# EAGLE design charlie_chain_v1 (EAGLE 5.11)
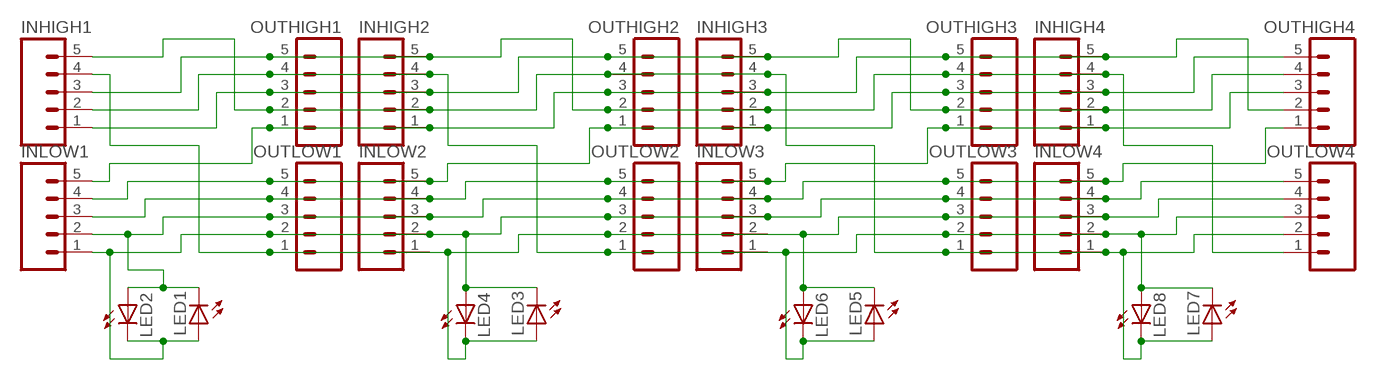
[diagram p0: schematic, sheet 1]

## Parts
INHIGH1  M05PTH  [1X05]
INHIGH2  M05PTH  [1X05]
INHIGH3  M05PTH  [1X05]
INHIGH4  M05PTH  [1X05]
INLOW1  M05PTH  [1X05]
INLOW2  M05PTH  [1X05]
INLOW3  M05PTH  [1X05]
INLOW4  M05PTH  [1X05]
LED1  LED10MM  [LED10MM]
LED2  LED10MM  [LED10MM]
LED3  LED10MM  [LED10MM]
LED4  LED10MM  [LED10MM]
LED5  LED10MM  [LED10MM]
LED6  LED10MM  [LED10MM]
LED7  LED10MM  [LED10MM]
LED8  LED10MM  [LED10MM]
OUTHIGH1  M05PTH  [1X05]
OUTHIGH2  M05PTH  [1X05]
OUTHIGH3  M05PTH  [1X05]
OUTHIGH4  M05PTH  [1X05]
OUTLOW1  M05PTH  [1X05]
OUTLOW2  M05PTH  [1X05]
OUTLOW3  M05PTH  [1X05]
OUTLOW4  M05PTH  [1X05]

## Nets
N$2: INHIGH1.2 INHIGH2.4 INLOW4.2 LED5.A LED6.K(C) LED7.K(C) LED8.A OUTHIGH1.4 OUTLOW2.1 OUTLOW3.2 OUTLOW4.3
N$10: INHIGH4.1 INLOW1.3 INLOW2.4 INLOW3.5 OUTHIGH3.1 OUTHIGH4.3 OUTLOW1.4 OUTLOW2.5
N$11: INHIGH3.1 INHIGH4.3 INLOW1.4 INLOW2.5 OUTHIGH2.1 OUTHIGH3.3 OUTHIGH4.5 OUTLOW1.5
N$12: INHIGH2.1 INHIGH3.3 INHIGH4.5 INLOW1.5 OUTHIGH1.1 OUTHIGH2.3 OUTHIGH3.5 OUTHIGH4.2
N$13: INHIGH1.1 INHIGH2.3 INHIGH3.5 INHIGH4.2 OUTHIGH1.3 OUTHIGH2.5 OUTHIGH3.2 OUTHIGH4.4
N$14: INLOW1.2 INLOW2.3 INLOW3.4 INLOW4.5 LED1.K(C) LED2.A OUTHIGH4.1 OUTLOW1.3 OUTLOW2.4 OUTLOW3.5
N$15: INLOW1.1 INLOW2.2 INLOW3.3 INLOW4.4 LED1.A LED2.K(C) LED3.K(C) LED4.A OUTLOW1.2 OUTLOW2.3 OUTLOW3.4 OUTLOW4.5
N$17: INHIGH1.3 INHIGH2.5 INHIGH3.2 INHIGH4.4 OUTHIGH1.5 OUTHIGH2.2 OUTHIGH3.4 OUTLOW4.1
N$18: INHIGH1.4 INLOW4.3 LED3.A LED4.K(C) LED5.K(C) LED6.A OUTLOW1.1 OUTLOW2.2 OUTLOW3.3 OUTLOW4.4
N$20: INLOW2.1
N$36: INHIGH1.5 INHIGH2.2 INHIGH3.4 INLOW4.1 LED7.A LED8.K(C) OUTHIGH1.2 OUTHIGH2.4 OUTLOW3.1 OUTLOW4.2
Unconnected: INLOW3.1 INLOW3.2

## Library data of the parts
INHIGH1-INHIGH4 INLOW1-INLOW4 OUTHIGH1-OUTHIGH4 OUTLOW1-OUTLOW4 = SparkFun:M05: Header 5 Standard 5-pin 0.1" header. Use with straight break away headers (SKU : PRT-00116), right angle break away headers (PRT-00553), swiss pins (PRT-00743), machine pins (PRT-00117), and female headers (PRT-00115). Molex polarized connector foot print use with SKU : PRT-08230 with associated crimp pins and housings.
LED1-LED8 = led:LED: LED OSRAM: - CHIPLED LG R971, LG N971, LY N971, LG Q971, LY Q971, LO R971, LY R971 LH N974, LH R974 LS Q976, LO Q976, LY Q976 LO Q996 - Hyper CHIPLED LW Q18S LB Q993, LB Q99A, LB R99A - SideLED LS A670, LO A670, LY A670, LG A670, LP A670 LB A673, LV A673, LT A673, LW A673 LH A674 LY A675 LS A676, LA A676, LO A676, LY A676, LW A676 LS A679, LY A679, LG A679 - Hyper Micro SIDELED® LS Y876, LA Y876, LO Y876, LY Y876 LT Y87S - SmartLED LW L88C, LW L88S LB L89C, LB L89S, LG L890 LS L89K, LO L89K, LY L89K LS L896, LA L896, LO L896, LY L896 - TOPLED LS T670, LO T670, LY T670, LG T670, LP T670 LSG T670, LSP T670, LSY T670, LOP T670, LYG T670 LG T671, LOG T671, LSG T671 LB T673, LV T673, LT T673, LW T673 LH T674 LS T676, LA T676, LO T676, LY T676, LB T676, LH T676, LSB T676, LW T676 LB T67C, LV T67C, LT T67C, LS T67K, LO T67K, LY T67K, LW E67C LS E67B, LA E67B, LO E67B, LY E67B, LB E67C, LV E67C, LT E67C LW T67C LS T679, LY T679, LG T679 LS T770, LO T770, LY T770, LG T770, LP T770 LB T773, LV T773, LT T773, LW T773 LH T774 LS E675, LA E675, LY E675, LS T675 LS T776, LA T776, LO T776, LY T776, LB T776 LHGB T686 LT T68C, LB T68C - Hyper Mini TOPLED® LB M676 - Mini TOPLED Santana® LG M470 LS M47K, LO M47K, LY M47K Source: http://www.osram.convergy.de LUXEON: - LUMILED® LXK2-PW12-R00, LXK2-PW12-S00, LXK2-PW14-U00, LXK2-PW14-V00 LXK2-PM12-R00, LXK2-PM12-S00, LXK2-PM14-U00 LXK2-PE12-Q00, LXK2-PE12-R00, LXK2-PE12-S00, LXK2-PE14-T00, LXK2-PE14-U00 LXK2-PB12-K00, LXK2-PB12-L00, LXK2-PB12-M00, LXK2-PB14-N00, LXK2-PB14-P00, LXK2-PB14-Q00 LXK2-PR12-L00, LXK2-PR12-M00, LXK2-PR14-Q00, LXK2-PR14-R00 LXK2-PD12-Q00, LXK2-PD12-R00, LXK2-PD12-S00 LXK2-PH12-R00, LXK2-PH12-S00 LXK2-PL12-P00, LXK2-PL12-Q00, LXK2-PL12-R00 Source: www.luxeon.com KINGBRIGHT: KA-3528ASYC Source: www.kingbright.com

## Board
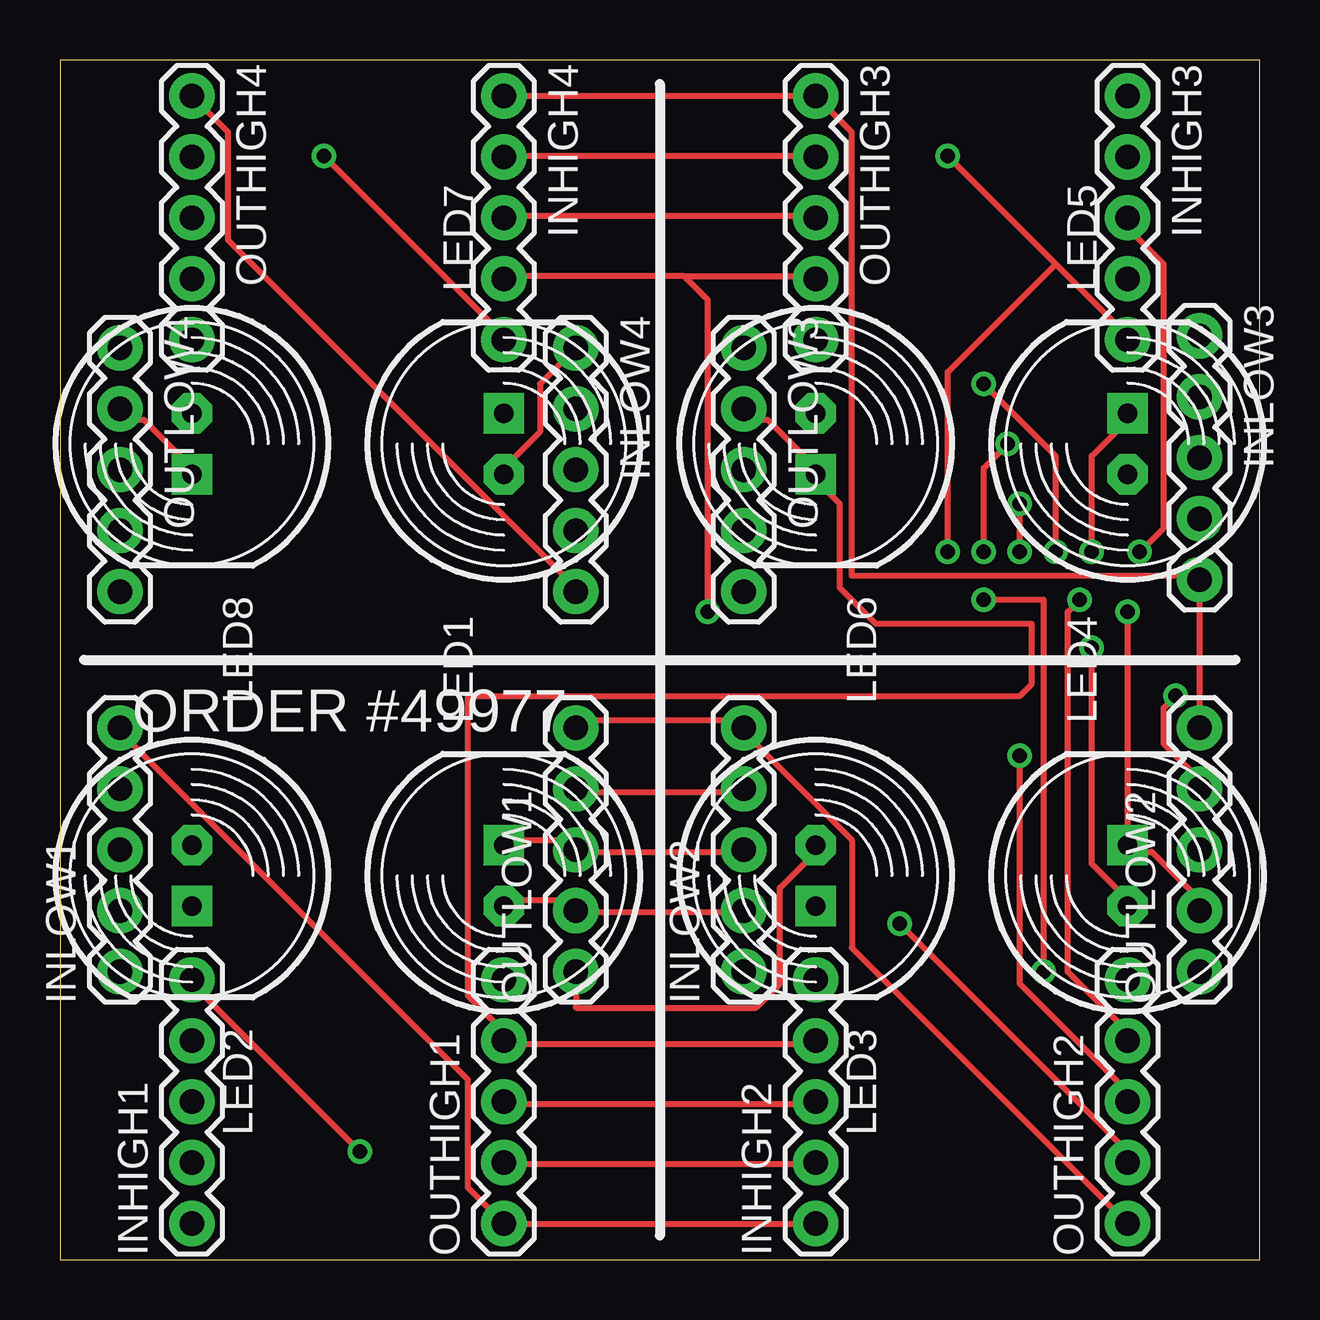
[diagram p1: board, top side]
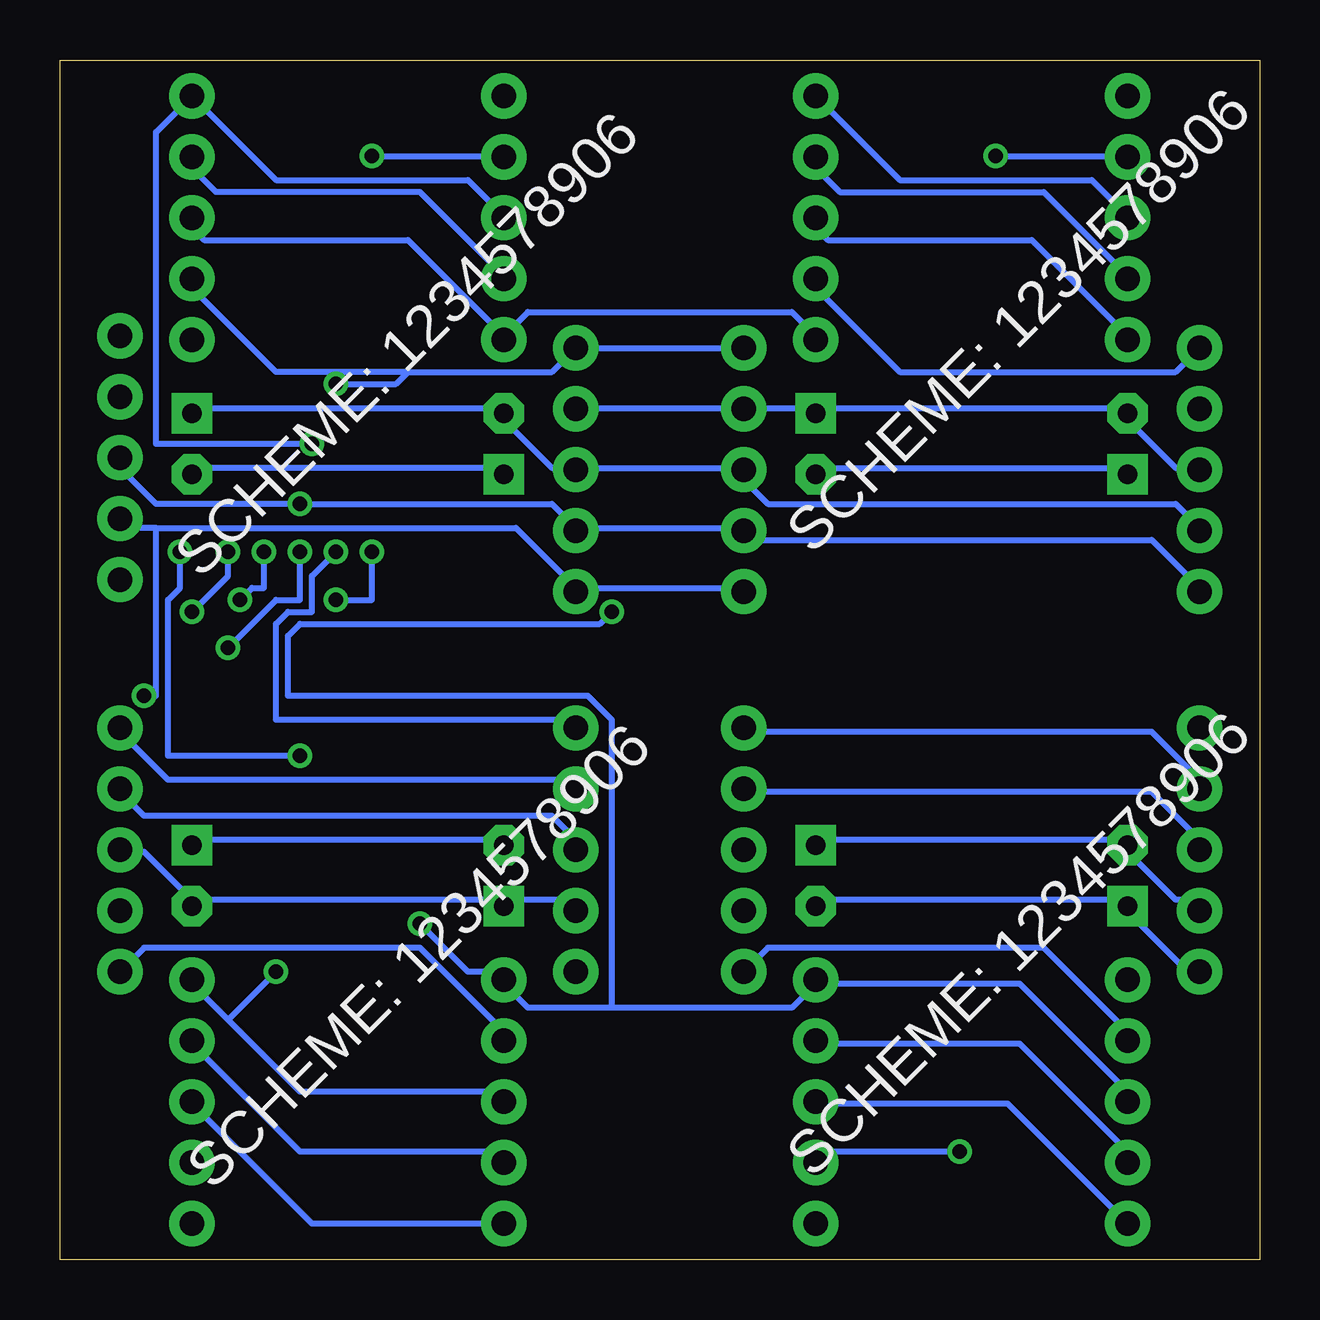
[diagram p2: board, bottom side, seen from below]

Size 50 x 50 mm. Coordinates in mm from the lower left corner, seen from the top.
Outline: 0,0 50,0 50,50 0,50 0,0
Copper layers (1*16): Top 0.035mm / dielectric 1.5mm / Bottom 0.035mm
Design rules "default": minimum track width 10mil, minimum drill 24mil, track to track 8mil, track to pad 8mil, pad to pad 8mil, via to via 8mil, smd to smd 8mil, copper to edge 40mil, drill to drill 8mil, minimum pad ring 10mil, minimum via ring 8mil, stop-mask expansion 4mil, vias tented up to drill 0mil, thermal gap 10mil
tRestrict: area 0,24 to 40,26
bRestrict: area 0,24 to 40,26

### Footprints (pad centres in the part's own frame; a part is rotated, then mirrored left to right if it is on the bottom)
1X05 = drill 1.016 pad 1.88 round: 1 0,0; 2 2.54,0; 3 5.08,0; 4 7.62,0; 5 10.16,0
LED10MM = drill 0.813 pad 1.676 octagon: A -1.27,0 | drill 0.813 pad 1.676 square: K 1.27,0

### Placement (x,y rotation side)
INHIGH1  5.5,1.5 90 top
INHIGH2  31.5,1.5 90 top
INHIGH3  44.5,48.5 270 top
INHIGH4  18.5,48.5 270 top
INLOW1  2.5,12 90 top
INLOW2  28.5,12 90 top
INLOW3  47.5,38.5 270 top
INLOW4  21.5,38 270 top
LED1  18.5,16 90 top
LED2  5.5,16 270 top
LED3  31.5,16 270 top
LED4  44.5,16 90 top
LED5  44.5,34 90 top
LED6  31.5,34 270 top
LED7  18.5,34 90 top
LED8  5.5,34 270 top
OUTHIGH1  18.5,1.5 90 top
OUTHIGH2  44.5,1.5 90 top
OUTHIGH3  31.5,48.5 270 top
OUTHIGH4  5.5,48.5 270 top
OUTLOW1  21.5,12 90 top
OUTLOW2  47.5,12 90 top
OUTLOW3  28.5,38 270 top
OUTLOW4  2.5,38 270 top

### Tracks (layer width: path | path; a pad name or v marks a point on that pad's centre or on a via)
N$2
  Top 0.254: INHIGH2.4 31.5,9 18.5,9 OUTHIGH1.4 18.5,9.5 17,11 17,23.5 40,23.5 40.5,24 40.5,26.5 34,26.5 32.5,28 32.5,31.5 31.5,32.5 LED6.K 31.5,33 29.5,35 28.5,35 OUTLOW3.2
  Bottom 0.254: OUTLOW4.3 2.5,33 3.5,33 5.5,35 LED8.A 5.5,35.5 18.5,35.5 | INHIGH1.2 5.5,4.5 10,9 18.5,9 OUTHIGH1.4 | OUTLOW2.1 46.5,13 35,13 31.5,9.5 INHIGH2.4 | LED5.A 44.5,33 31.5,33 LED6.K | 21.5,35.5 18.5,35.5 | 18.5,35.5 LED7.K | 21.5,35.5 28.5,35.5 OUTLOW3.2 | 21.5,35.5 INLOW4.2
N$10
  Top 0.254: INLOW2.4 28.5,19.5 21.5,19.5 OUTLOW1.4 | INHIGH4.1 OUTHIGH3.1 33,47 33,28.5 47.5,28.5 INLOW3.5 OUTLOW2.5
  Bottom 0.254: INLOW1.3 2.5,17.5 4.5,19.5 21.5,19.5 OUTLOW1.4 | OUTLOW2.5 47.5,22 45.5,20 28.5,20 INLOW2.4 | INHIGH4.1 15,45 7,45 5.5,43.5 OUTHIGH4.3
N$11  (via drill 0.61)
  Top 0.254: OUTLOW1.5 21.5,22.5 28.5,22.5 INLOW2.5 28.5,22 33,17.5 33,13 OUTHIGH2.1 | INHIGH4.3 18.5,43.5 31.5,43.5 OUTHIGH3.3 | v39.5,34 38.5,33 v38.5,29.5
  Bottom 0.254: INLOW1.4 2.5,20 4.5,22 21.5,22 OUTLOW1.5 | OUTHIGH3.3 31.5,43.5 33,45 41,45 INHIGH3.1 46,47 46,34 v39.5,34 | OUTHIGH4.5 5.5,38.5 9.5,42.5 18,42.5 18.5,43 INHIGH4.3 | v38.5,29.5 39.5,28.5 39.5,27 40.5,27 41,26.5 41,22.5 28.5,22.5 INLOW2.5
N$12  (via drill 0.61)
  Top 0.254: INHIGH2.1 OUTHIGH1.1 17,3 17,7.5 2.5,22 INLOW1.5 | v11,46 18.5,38.5 INHIGH4.5 | v45,29.5 46,30.5 46,41.5 44.5,43 INHIGH3.3 | v40,21 40,11.5 44.5,7 OUTHIGH2.3
  Bottom 0.254: INHIGH2.1 39.5,1.5 44.5,6.5 OUTHIGH2.3 | 31.5,38.5 35.5,42.5 44,42.5 44.5,43 INHIGH3.3 | v11,46 5.5,46 OUTHIGH4.2 | 31.5,38.5 30.5,39.5 19.5,39.5 18.5,38.5 INHIGH4.5 | 31.5,38.5 OUTHIGH3.5 | v45,29.5 45,28 45.5,27.5 45.5,21 v40,21
N$13  (via drill 0.61)
  Top 0.254: INHIGH2.3 31.5,6.5 18.5,6.5 OUTHIGH1.3 | 41.5,41.5 v37,46 | 41.5,41.5 44.5,38.5 INHIGH3.5 | INHIGH4.2 18.5,46 31.5,46 OUTHIGH3.2 | 41.5,41.5 37,37 v37,29.5 | v38.5,27.5 41,27.5 v41,12
  Bottom 0.254: INHIGH1.1 10.5,6.5 18.5,6.5 OUTHIGH1.3 | 43,10 40,7 31.5,7 INHIGH2.3 | 43,10 44.5,11.5 OUTHIGH2.5 | v37,46 31.5,46 OUTHIGH3.2 | OUTHIGH4.4 5.5,41 9,44.5 17.5,44.5 18.5,45.5 INHIGH4.2 | v37,29.5 37,27.5 v38.5,27.5 | 43,10 v41,12
N$14  (via drill 0.61)
  Top 0.254: LED1.K 18.5,17.5 21.5,17.5 OUTLOW1.3 21.5,17 28.5,17 INLOW2.3 | OUTHIGH4.1 7,47 7,42.5 21.5,28 INLOW4.5 | v46.5,23.5 46,23 46,21.5 47.5,20 OUTLOW2.4
  Bottom 0.254: INLOW1.2 2.5,15 3.5,15 5.5,17 LED2.A 5.5,17.5 18.5,17.5 LED1.K | OUTLOW2.4 47.5,19.5 46.5,18.5 29.5,18.5 28.5,17.5 INLOW2.3 | 28.5,28 31,30.5 46,30.5 | 46,30.5 47.5,30.5 INLOW3.4 | 28.5,28 21.5,28 INLOW4.5 | 28.5,28 OUTLOW3.5 | 46,30.5 46,23.5 v46.5,23.5
N$15  (via drill 0.61)
  Top 0.254: LED1.A 18.5,15 21.5,15 OUTLOW1.2 21.5,14.5 28.5,14.5 INLOW2.2 | v40,29.5 v40,31.5 | v43,25.5 43,16.5 44.5,15 LED4.A
  Bottom 0.254: INLOW1.1 3,12 5.5,14.5 LED2.K 5.5,15 18.5,15 LED1.A | 44.5,15 46.5,17 47.5,17 OUTLOW2.3 | 31.5,15 28.5,15 INLOW2.2 | 31.5,15 44.5,15 | 44.5,15 LED4.A | 31.5,15 LED3.K | 28.5,30.5 29.5,31.5 v40,31.5 46,31.5 47.5,33 INLOW3.3 | OUTLOW4.5 2.5,28 4.5,30 21.5,30 INLOW4.4 21.5,30.5 28.5,30.5 | 28.5,30.5 OUTLOW3.4 | v40,29.5 40,27.5 41,27.5 v43,25.5
N$17  (via drill 0.61)
  Top 0.254: v35,14 44.5,4.5 OUTHIGH2.2 | 26,41 18.5,41 INHIGH4.4 | 26,41 31.5,41 OUTHIGH3.4 | 26,41 27,40 v27,27
  Bottom 0.254: 18.5,11.5 10,11.5 5.5,7 INHIGH1.3 | 27,10.5 19.5,10.5 18.5,11.5 | 27,10.5 30.5,10.5 31.5,11.5 INHIGH2.5 31.5,12 33,12 v35,14 | 18.5,11.5 OUTHIGH1.5 | OUTHIGH3.4 31.5,41 35,44.5 43.5,44.5 44.5,45.5 INHIGH3.2 | OUTLOW4.1 3.5,37 15,37 18.5,40.5 INHIGH4.4 | v27,27 27.5,26.5 40,26.5 40.5,26 40.5,23.5 28,23.5 27,22.5 27,10.5
N$18  (via drill 0.61)
  Top 0.254: OUTLOW2.2 47.5,15 45.5,17 44.5,17 LED4.K v44.5,27 | OUTLOW1.1 21.5,10.5 29,10.5 30,11.5 30,15.5 31.5,17 LED3.A | v43,29.5 43,33.5 44.5,35 LED5.K
  Bottom 0.254: LED3.A 31.5,17.5 44.5,17.5 LED4.K | OUTLOW1.1 20.5,13 9,13 5.5,9.5 INHIGH1.4 | 28.5,33 29.5,33 31.5,35 LED6.A 31.5,35.5 44.5,35.5 LED5.K | OUTLOW4.4 2.5,30.5 3.5,31.5 20.5,31.5 21.5,32.5 INLOW4.3 21.5,33 28.5,33 | 28.5,33 OUTLOW3.3 | v43,29.5 43,28.5 v44.5,27
N$36  (via drill 0.61)
  Top 0.254: OUTHIGH1.2 18.5,4 31.5,4 INHIGH2.2 | v12.5,4.5 5.5,11.5 INHIGH1.5 | LED8.K 5.5,33 3.5,35 2.5,35 OUTLOW4.2 | INLOW4.1 20,36.5 20,34.5 18.5,33 LED7.A | v38.5,36.5 41.5,33.5 v41.5,29.5 | v42.5,27.5 42,27 42,12 44.5,9.5 OUTHIGH2.4
  Bottom 0.254: 35.5,37 29.5,37 OUTLOW3.1 INLOW4.1 | 35.5,37 41,37 44.5,40.5 INHIGH3.4 | v12.5,4.5 18.5,4.5 OUTHIGH1.2 | OUTHIGH2.4 44.5,9 40,4.5 31.5,4.5 INHIGH2.2 | LED8.K 5.5,33 18.5,33 LED7.A | 35.5,37 36,36.5 v38.5,36.5 | v41.5,29.5 41.5,28 42,28 v42.5,27.5

### Text on the board
tNames: ORDER #49977
bNames: SCHEME: 1234578906 | SCHEME: 1234578906 | SCHEME: 1234578906 | SCHEME: 1234578906